# EAGLE schematic ehomeGeneral_v1 (EAGLE 8.7.0)
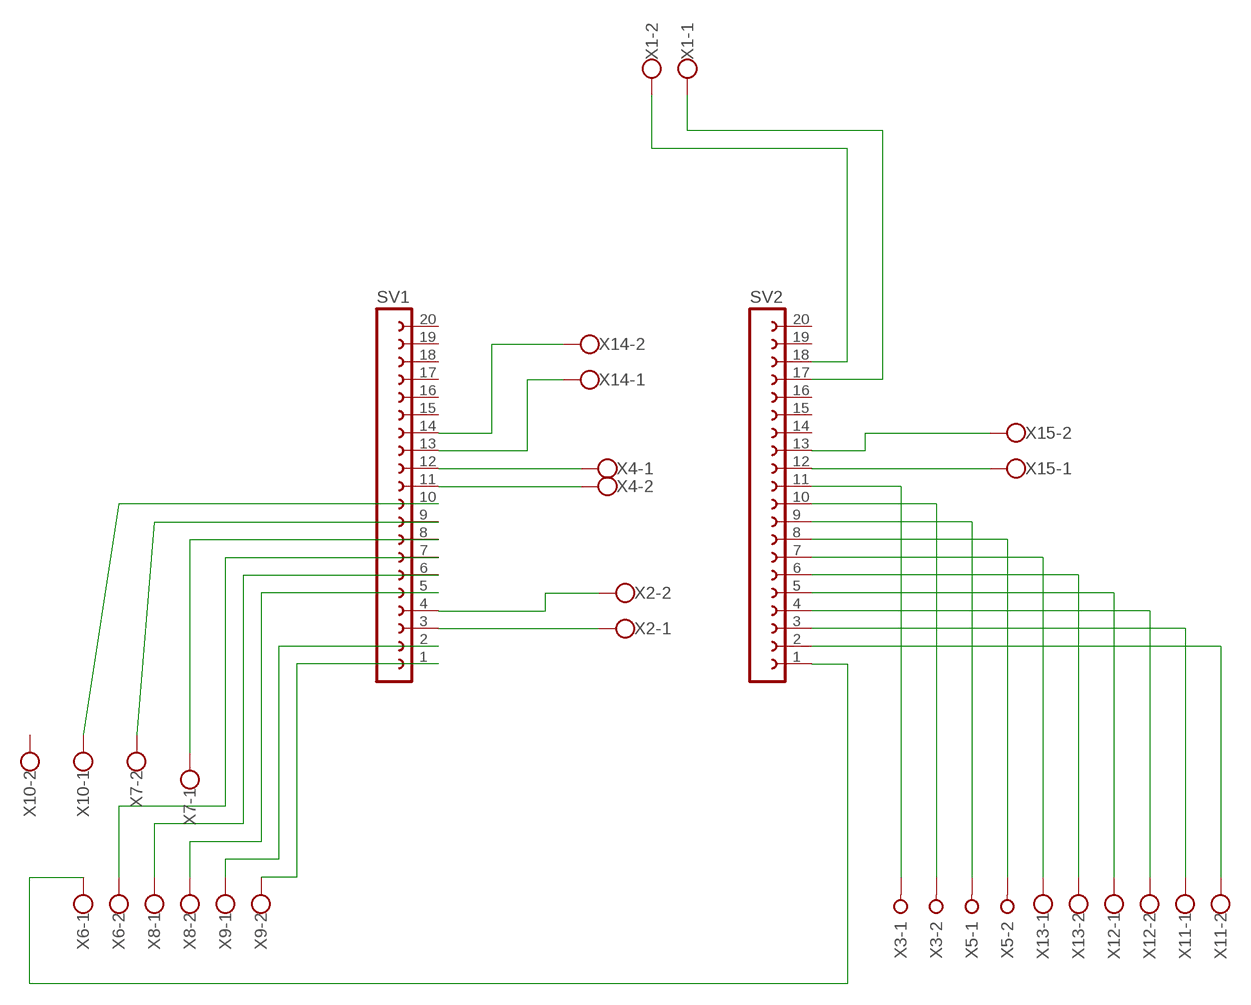
[diagram p0: schematic, sheet 1]

## Parts
SV1  FE20-1  [FE20]
SV2  FE20-1  [FE20]
X1  W237-102  [W237-102]
X2  W237-102  [W237-102]
X3  W237-02P  [W237-132]
X4  W237-102  [W237-102]
X5  W237-02P  [W237-132]
X6  W237-102  [W237-102]
X7  W237-102  [W237-102]
X8  W237-102  [W237-102]
X9  W237-102  [W237-102]
X10  W237-102  [W237-102]
X11  W237-102  [W237-102]
X12  W237-102  [W237-102]
X13  W237-102  [W237-102]
X14  W237-102  [W237-102]
X15  W237-102  [W237-102]

## Nets
EN: SV2.1 X6.1
GND: SV2.17 X1.1
GND1: SV1.3 X2.1
GPIO0: SV1.14 X14.2
GPIO2: SV1.12 X4.1
GPIO4: SV1.11 X4.2
GPIO5: SV1.8 X7.1
GPIO12: SV2.12 X15.1
GPIO13: SV2.13 X15.2
GPIO14: SV2.11 X3.1
GPIO15: SV1.13 X14.1
GPIO16: SV1.10 X10.1
GPIO17: SV1.9 X7.2
GPIO18: SV1.7 X6.2
GPIO19: SV1.6 X8.1
GPIO21: SV1.5 X8.2
GPIO22: SV1.2 X9.1
GPIO23: SV1.1 X9.2
GPIO25: SV2.8 X5.2
GPIO26: SV2.9 X5.1
GPIO27: SV2.10 X3.2
GPIO32: SV2.6 X13.2
GPIO33: SV2.7 X13.1
GPIO34: SV2.4 X12.2
GPIO35: SV2.5 X12.1
GPIO36: SV2.2 X11.2
GPIO39: SV2.3 X11.1
PWR: SV2.18 X1.2
PWR1: SV1.4 X2.2
Unconnected: SV1.15 SV1.16 SV1.17 SV1.18 SV1.19 SV1.20 SV2.14 SV2.15 SV2.16 SV2.19 SV2.20 X10.2

## Library data of the parts
SV1 SV2 = con-lsta:FE20-1: FEMALE HEADER; OC_FARNELL: unknown; OC_NEWARK: unknown
X1 X2 X4 X6-X15 = con-wago-500:W237-102: WAGO SCREW CLAMP; MPN: 237-102; OC_FARNELL: unknown; OC_NEWARK: 70K9898
X3 X5 = con-wago-508:W237-02P: WAGO SREW CLAMP; OC_FARNELL: unknown; OC_NEWARK: unknown